# Altium schematic sheet LPC1830 Main Controller.SchDoc
size C
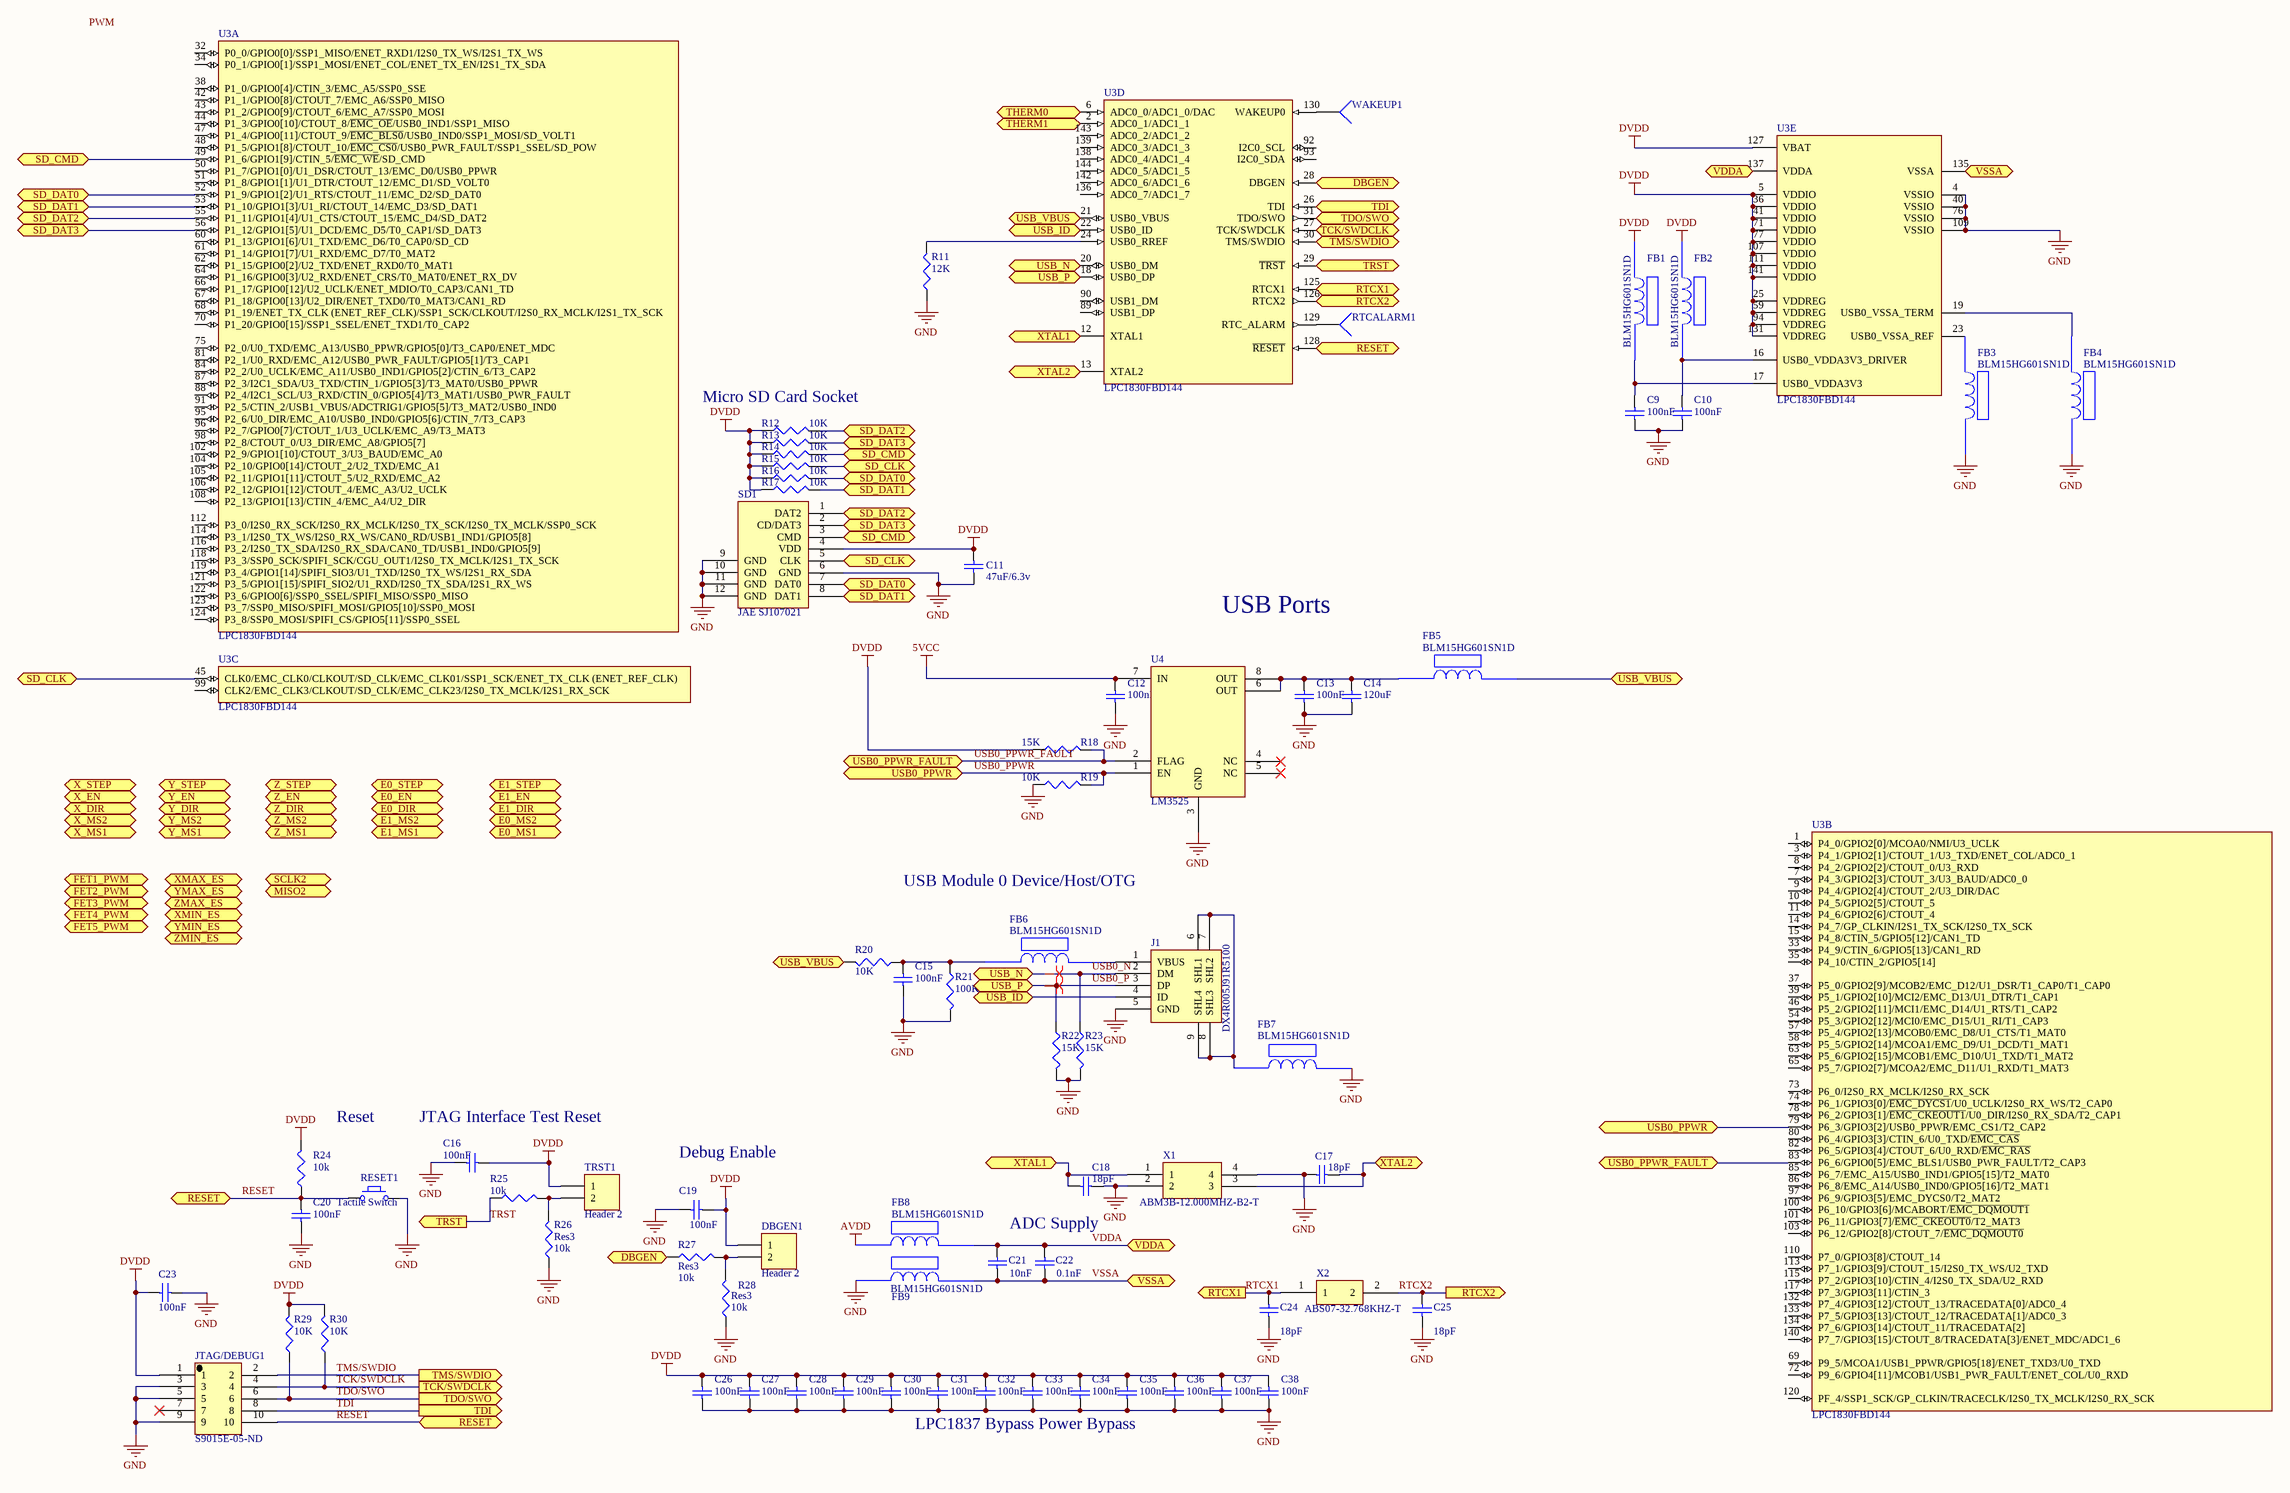
[diagram p0: LPC1830 Main Controller.SchDoc]

## Parts
C9  value 100nF  [0402]  (hidden comment: Cap Semi)
C10  value 100nF  [0402]  (hidden comment: Cap Semi)
C11  value 47uF/6.3v  [Panasonic VS B]  (hidden comment: Cap Semi)
C12  value 100nF  [1608[0603]]  (hidden comment: Cap Semi)
C13  value 100nF  [1608[0603]]  (hidden comment: Cap Semi)
C14  value 120uF  [1608[0603]]  (hidden comment: Cap Semi)
C15  value 100nF  [1608[0603]]  (hidden comment: Cap Semi)
C16  C1: 100nF  [CAPC1608L]  (hidden comment: Cap Semi)
C17  value 18pF  [1608[0603]]  (hidden comment: Cap Semi)
C18  value 18pF  [1608[0603]]  (hidden comment: Cap Semi)
C19  C1: 100nF  [CAPC1608L]  (hidden comment: Cap Semi)
C20  C1: 100nF  [CAPC1608L]  (hidden comment: Cap Semi)
C21  value 10nF  [1608[0603]]  (hidden comment: Cap Semi)
C22  value 0.1nF  [1608[0603]]  (hidden comment: Cap Semi)
C23  C1: 100nF  [CAPC1608L]  (hidden comment: Cap Semi)
C24  value 18pF  [1608[0603]]  (hidden comment: Cap Semi)
C25  value 18pF  [1608[0603]]  (hidden comment: Cap Semi)
C26  value 100nF  [1608[0603]]  (hidden comment: Cap Semi)
C27  value 100nF  [1608[0603]]  (hidden comment: Cap Semi)
C28  value 100nF  [1608[0603]]  (hidden comment: Cap Semi)
C29  value 100nF  [1608[0603]]  (hidden comment: Cap Semi)
C30  value 100nF  [1608[0603]]  (hidden comment: Cap Semi)
C31  value 100nF  [1608[0603]]  (hidden comment: Cap Semi)
C32  value 100nF  [1608[0603]]  (hidden comment: Cap Semi)
C33  value 100nF  [1608[0603]]  (hidden comment: Cap Semi)
C34  value 100nF  [1608[0603]]  (hidden comment: Cap Semi)
C35  value 100nF  [1608[0603]]  (hidden comment: Cap Semi)
C36  value 100nF  [1608[0603]]  (hidden comment: Cap Semi)
C37  value 100nF  [1608[0603]]  (hidden comment: Cap Semi)
C38  value 100nF  [1608[0603]]  (hidden comment: Cap Semi)
DBGEN1  Header 2  [HDR1X2]
FB1  BLM15HG601SN1D  [BLM18PG121SN1D]
FB2  BLM15HG601SN1D  [BLM18PG121SN1D]
FB3  BLM15HG601SN1D  [BLM18PG121SN1D]
FB4  BLM15HG601SN1D  [BLM18PG121SN1D]
FB5  BLM15HG601SN1D  [BLM18PG121SN1D]
FB6  BLM15HG601SN1D  [BLM18PG121SN1D]
FB7  BLM15HG601SN1D  [BLM18PG121SN1D]
FB8  BLM15HG601SN1D  [BLM18PG121SN1D]
FB9  BLM15HG601SN1D  [BLM18PG121SN1D]
J1  DX4R005J91R5100  [Micro USB Circular Holes Only]
JTAG/DEBUG1  S9015E-05-ND  [S9015E-05-ND]
R11  value 12K  [J1-0603]  (hidden comment: Res3)
R12  value 10K  [J1-0603]  (hidden comment: Res3)
R13  value 10K  [J1-0603]  (hidden comment: Res3)
R14  value 10K  [J1-0603]  (hidden comment: Res3)
R15  value 10K  [J1-0603]  (hidden comment: Res3)
R16  value 10K  [J1-0603]  (hidden comment: Res3)
R17  value 10K  [J1-0603]  (hidden comment: Res3)
R18  value 15K  [J1-0603]  (hidden comment: Res3)
R19  value 10K  [J1-0603]  (hidden comment: Res3)
R20  value 10K  [J1-0603]  (hidden comment: Res3)
R21  value 100K  [J1-0603]  (hidden comment: Res3)
R22  value 15K  [J1-0603]  (hidden comment: Res3)
R23  value 15K  [J1-0603]  (hidden comment: Res3)
R24  value 10k  [J1-0603]  (hidden comment: Res3)
R25  value 10k  [J1-0603]  (hidden comment: Res3)
R26  Res3  value 10k  [J1-0603]
R27  Res3  value 10k  [J1-0603]
R28  Res3  value 10k  [J1-0603]
R29  value 10K  [J1-0603]  (hidden comment: Res3)
R30  value 10K  [J1-0603]  (hidden comment: Res3)
RESET1  Tactile Switch  [TL3301]
RTCALARM1  Socket  [PIN1]  (value not drawn)
SD1  JAE SJ107021  [JAE SJ107021]
TRST1  Header 2  [HDR1X2]
U3  LPC1830FBD144  [SOT486-1_V]  (parts A,B,C,D,E of 5)
U4  LM3525  [LM3525]
WAKEUP1  Socket  [PIN1]  (value not drawn)
X1  ABM3B-12.000MHZ-B2-T  [ABM3B-12.000MHZ-B2-T]
X2  ABS07-32.768KHZ-T  [ABS07-32.768KHZ-T]

## Ports
DBGEN (in), DBGEN (out), E0_DIR, E0_EN, E0_MS1, E0_MS2, E0_STEP, E1_DIR, E1_EN, E1_MS1, E1_MS2, E1_STEP, FET1_PWM, FET2_PWM, FET3_PWM, FET4_PWM, FET5_PWM, MISO2, RESET (bidir), RTCX1 (in), RTCX1 (out), RTCX2 (out), SCLK2, SD_CLK (bidir), SD_CMD (bidir), SD_DAT0 (bidir), SD_DAT1 (bidir), SD_DAT2 (bidir), SD_DAT3 (bidir), TCK/SWDCLK (in), TCK/SWDCLK (out), TDI (in), TDI (out), TDO/SWO (out), THERM0, THERM1, TMS/SWDIO (in), TMS/SWDIO (out), TRST (in), TRST (out), USB0_PPWR (bidir), USB0_PPWR_FAULT (bidir), USB_ID (bidir), USB_N (bidir), USB_P (bidir), USB_VBUS (bidir), VDDA, VSSA, X_DIR, X_EN, X_MS1, X_MS2, X_STEP, XMAX_ES, XMIN_ES, XTAL1 (bidir), XTAL2 (bidir), Y_DIR, Y_EN, Y_MS1, Y_MS2, Y_STEP, YMAX_ES, YMIN_ES, Z_DIR, Z_EN, Z_MS1, Z_MS2, Z_STEP, ZMAX_ES, ZMIN_ES

## Nets
5VCC: C12.2 U4.7(IN)
AVDD: FB8.1
DVDD: C11.2 C16.2 C19.2 C23.1 C26.2 C27.2 C28.2 C29.2 C30.2 C31.2 C32.2 C33.2 C34.2 C35.2 C36.2 C37.2 C38.2 DBGEN1.1 FB1.1 FB2.1 JTAG/DEBUG1.1 R12.1 R13.1 R14.1 R15.1 R16.1 R17.1 R18.1 R24.2 R29.2 R30.2 SD1.4(VDD) TRST1.1 U3.5(VDDIO) U3.25(VDDREG) U3.36(VDDIO) U3.41(VDDIO) U3.59(VDDREG) U3.71(VDDIO) U3.77(VDDIO) U3.94(VDDREG) U3.107(VDDIO) U3.111(VDDIO) U3.127(VBAT) U3.131(VDDREG) U3.141(VDDIO)
GND: C9.1 C10.1 C11.1 C12.1 C13.1 C14.1 C15.1 C16.1 C17.2 C18.1 C19.1 C20.1 C23.2 C24.1 C25.1 C26.1 C27.1 C28.1 C29.1 C30.1 C31.1 C32.1 C33.1 C34.1 C35.1 C36.1 C37.1 C38.1 FB3.2 FB4.2 FB7.2 FB9.1 J1.5(GND) JTAG/DEBUG1.3 JTAG/DEBUG1.5 JTAG/DEBUG1.9 R11.1 R19.1 R21.2 R22.2 R23.2 R26.1 R28.1 RESET1.2 SD1.6(GND) SD1.9(GND) SD1.10(GND) SD1.11(GND) SD1.12(GND) U3.4(VSSIO) U3.40(VSSIO) U3.76(VSSIO) U3.109(VSSIO) U4.3(GND) X1.2 X1.4
DBGEN: R27.1 U3.28(DBGEN) ; port DBGEN
RESET: C20.2 JTAG/DEBUG1.10 R24.1 RESET1.1 U3.128(~{RESET}) ; port RESET
RTCX1: C24.2 U3.125(RTCX1) X2.1 ; port RTCX1
RTCX2: C25.2 U3.126(RTCX2) X2.2 ; port RTCX2
SD_CLK: R15.2 SD1.5(CLK) U3.45(CLK0/EMC_CLK0/CLKOUT/SD_CLK/EMC_CLK01/SSP1_SCK/ENET_TX_CLK_(ENET_REF_CLK)) ; port SD_CLK
SD_CMD: R14.2 SD1.3(CMD) U3.49(P1_6/GPIO1[9]/CTIN_5/~{EMC_WE}/SD_CMD) ; port SD_CMD
SD_DAT0: R16.2 SD1.7(DAT0) U3.52(P1_9/GPIO1[2]/U1_RTS/CTOUT_11/EMC_D2/SD_DAT0) ; port SD_DAT0
SD_DAT1: R17.2 SD1.8(DAT1) U3.53(P1_10/GPIO1[3]/U1_RI/CTOUT_14/EMC_D3/SD_DAT1) ; port SD_DAT1
SD_DAT2: R12.2 SD1.1(DAT2) U3.55(P1_11/GPIO1[4]/U1_CTS/CTOUT_15/EMC_D4/SD_DAT2) ; port SD_DAT2
SD_DAT3: R13.2 SD1.2(CD/DAT3) U3.56(P1_12/GPIO1[5]/U1_DCD/EMC_D5/T0_CAP1/SD_DAT3) ; port SD_DAT3
TCK/SWDCLK: JTAG/DEBUG1.4 R30.1 U3.27(TCK/SWDCLK) ; port TCK/SWDCLK
TDI: JTAG/DEBUG1.8 U3.26(TDI) ; port TDI
TDO/SWO: JTAG/DEBUG1.6 R29.1 U3.31(TDO/SWO) ; port TDO/SWO
THERM0: U3.6(ADC0_0/ADC1_0/DAC) ; port THERM0
THERM1: U3.2(ADC0_1/ADC1_1) ; port THERM1
TMS/SWDIO: JTAG/DEBUG1.2 U3.30(TMS/SWDIO) ; port TMS/SWDIO
TRST: R25.1 U3.29(~{TRST}) ; port TRST
USB0_N: J1.2(DM) R23.1 U3.20(USB0_DM) ; port USB_N
USB0_P: J1.3(DP) R22.1 U3.18(USB0_DP) ; port USB_P
USB0_PPWR: R19.2 U3.79(P6_3/GPIO3[2]/USB0_PPWR/EMC_CS1/T2_CAP2) U4.1(EN) ; port USB0_PPWR
USB0_PPWR_FAULT: R18.2 U3.83(P6_6/GPIO0[5]/EMC_BLS1/USB0_PWR_FAULT/T2_CAP3) U4.2(FLAG) ; port USB0_PPWR_FAULT
USB_ID: J1.4(ID) U3.22(USB0_ID) ; port USB_ID
USB_VBUS: FB5.2 R20.2 U3.21(USB0_VBUS) ; port USB_VBUS
VDDA: C21.2 C22.2 FB8.2 U3.137(VDDA) ; port VDDA
VSSA: C21.1 C22.1 FB9.2 U3.135(VSSA) ; port VSSA
XTAL1: C18.2 U3.12(XTAL1) X1.1 ; port XTAL1
XTAL2: C17.1 U3.13(XTAL2) X1.3 ; port XTAL2
NetC9_2: C9.2 FB1.2 U3.17(USB0_VDDA3V3)
NetC10_2: C10.2 FB2.2 U3.16(USB0_VDDA3V3_DRIVER)
NetC13_2: C13.2 C14.2 FB5.1 U4.6(OUT) U4.8(OUT)
NetC15_2: C15.2 FB6.1 R20.1 R21.1
NetDBGEN1_2: DBGEN1.2 R27.2 R28.2
NetFB3_1: FB3.1 U3.23(USB0_VSSA_REF)
NetFB4_1: FB4.1 U3.19(USB0_VSSA_TERM)
NetFB6_2: FB6.2 J1.1(VBUS)
NetFB7_1: FB7.1 J1.6(SHL1) J1.7(SHL2) J1.8(SHL3) J1.9(SHL4)
NetR11_2: R11.2 U3.24(USB0_RREF)
NetR25_2: R25.2 R26.2 TRST1.2
NetRTCALARM1_1: RTCALARM1.1 U3.129(RTC_ALARM)
NetU3_130: U3.130(WAKEUP0) WAKEUP1.1

Not connected (* = marked no-connect by the designer): JTAG/DEBUG1 7*; U3 1(P4_0/GPIO2[0]/MCOA0/NMI/U3_UCLK) 3(P4_1/GPIO2[1]/CTOUT_1/U3_TXD/ENET_COL/ADC0_1) 7(P4_3/GPIO2[3]/CTOUT_3/U3_BAUD/ADC0_0) 8(P4_2/GPIO2[2]/CTOUT_0/U3_RXD) 9(P4_4/GPIO2[4]/CTOUT_2/U3_DIR/DAC) 10(P4_5/GPIO2[5]/CTOUT_5) 11(P4_6/GPIO2[6]/CTOUT_4) 14(P4_7/GP_CLKIN/I2S1_TX_SCK/I2S0_TX_SCK) 15(P4_8/CTIN_5/GPIO5[12]/CAN1_TD) 32(P0_0/GPIO0[0]/SSP1_MISO/ENET_RXD1/I2S0_TX_WS/I2S1_TX_WS) 33(P4_9/CTIN_6/GPIO5[13]/CAN1_RD) 34(P0_1/GPIO0[1]/SSP1_MOSI/ENET_COL/ENET_TX_EN/I2S1_TX_SDA) 35(P4_10/CTIN_2/GPIO5[14]) 37(P5_0/GPIO2[9]/MCOB2/EMC_D12/U1_DSR/T1_CAP0/T1_CAP0) 38(P1_0/GPIO0[4]/CTIN_3/EMC_A5/SSP0_SSE) 39(P5_1/GPIO2[10]/MCI2/EMC_D13/U1_DTR/T1_CAP1) 42(P1_1/GPIO0[8]/CTOUT_7/EMC_A6/SSP0_MISO) 43(P1_2/GPIO0[9]/CTOUT_6/EMC_A7/SSP0_MOSI) 44(P1_3/GPIO0[10]/CTOUT_8/~{EMC_OE}/USB0_IND1/SSP1_MISO) 46(P5_2/GPIO2[11]/MCI1/EMC_D14/U1_RTS/T1_CAP2) 47(P1_4/GPIO0[11]/CTOUT_9/~{EMC_BLS0}/USB0_IND0/SSP1_MOSI/SD_VOLT1) 48(P1_5/GPIO1[8]/CTOUT_10/~{EMC_CS0}/USB0_PWR_FAULT/SSP1_SSEL/SD_POW) 50(P1_7/GPIO1[0]/U1_DSR/CTOUT_13/EMC_D0/USB0_PPWR) 51(P1_8/GPIO1[1]/U1_DTR/CTOUT_12/EMC_D1/SD_VOLT0) 54(P5_3/GPIO2[12]/MCI0/EMC_D15/U1_RI/T1_CAP3) 57(P5_4/GPIO2[13]/MCOB0/EMC_D8/U1_CTS/T1_MAT0) 58(P5_5/GPIO2[14]/MCOA1/EMC_D9/U1_DCD/T1_MAT1) 60(P1_13/GPIO1[6]/U1_TXD/EMC_D6/T0_CAP0/SD_CD) 61(P1_14/GPIO1[7]/U1_RXD/EMC_D7/T0_MAT2) 62(P1_15/GPIO0[2]/U2_TXD/ENET_RXD0/T0_MAT1) 63(P5_6/GPIO2[15]/MCOB1/EMC_D10/U1_TXD/T1_MAT2) 64(P1_16/GPIO0[3]/U2_RXD/ENET_CRS/T0_MAT0/ENET_RX_DV) 65(P5_7/GPIO2[7]/MCOA2/EMC_D11/U1_RXD/T1_MAT3) 66(P1_17/GPIO0[12]/U2_UCLK/ENET_MDIO/T0_CAP3/CAN1_TD) 67(P1_18/GPIO0[13]/U2_DIR/ENET_TXD0/T0_MAT3/CAN1_RD) 68(P1_19/ENET_TX_CLK_(ENET_REF_CLK)/SSP1_SCK/CLKOUT/I2S0_RX_MCLK/I2S1_TX_SCK) 69(P9_5/MCOA1/USB1_PPWR/GPIO5[18]/ENET_TXD3/U0_TXD) 70(P1_20/GPIO0[15]/SSP1_SSEL/ENET_TXD1/T0_CAP2) 72(P9_6/GPIO4[11]/MCOB1/USB1_PWR_FAULT/ENET_COL/U0_RXD) 73(P6_0/I2S0_RX_MCLK/I2S0_RX_SCK) 74(P6_1/GPIO3[0]/~{EMC_DYCS1}/U0_UCLK/I2S0_RX_WS/T2_CAP0) 75(P2_0/U0_TXD/EMC_A13/USB0_PPWR/GPIO5[0]/T3_CAP0/ENET_MDC) 78(P6_2/GPIO3[1]/~{EMC_CKEOUT1}/U0_DIR/I2S0_RX_SDA/T2_CAP1) 80(P6_4/GPIO3[3]/CTIN_6/U0_TXD/~{EMC_CAS}) 81(P2_1/U0_RXD/EMC_A12/USB0_PWR_FAULT/GPIO5[1]/T3_CAP1) 82(P6_5/GPIO3[4]/CTOUT_6/U0_RXD/~{EMC_RAS}) 84(P2_2/U0_UCLK/EMC_A11/USB0_IND1/GPIO5[2]/CTIN_6/T3_CAP2) 85(P6_7/EMC_A15/USB0_IND1/GPIO5[15]/T2_MAT0) 86(P6_8/EMC_A14/USB0_IND0/GPIO5[16]/T2_MAT1) 87(P2_3/I2C1_SDA/U3_TXD/CTIN_1/GPIO5[3]/T3_MAT0/USB0_PPWR) 88(P2_4/I2C1_SCL/U3_RXD/CTIN_0/GPIO5[4]/T3_MAT1/USB0_PWR_FAULT) 89(USB1_DP) 90(USB1_DM) 91(P2_5/CTIN_2/USB1_VBUS/ADCTRIG1/GPIO5[5]/T3_MAT2/USB0_IND0) 92(I2C0_SCL) 93(I2C0_SDA) 95(P2_6/U0_DIR/EMC_A10/USB0_IND0/GPIO5[6]/CTIN_7/T3_CAP3) 96(P2_7/GPIO0[7]/CTOUT_1/U3_UCLK/EMC_A9/T3_MAT3) 97(P6_9/GPIO3[5]/EMC_DYCS0/T2_MAT2) 98(P2_8/CTOUT_0/U3_DIR/EMC_A8/GPIO5[7]) 99(CLK2/EMC_CLK3/CLKOUT/SD_CLK/EMC_CLK23/I2S0_TX_MCLK/I2S1_RX_SCK) 100(P6_10/GPIO3[6]/MCABORT/~{EMC_DQMOUT1}) 101(P6_11/GPIO3[7]/~{EMC_CKEOUT0}/T2_MAT3) 102(P2_9/GPIO1[10]/CTOUT_3/U3_BAUD/EMC_A0) 103(P6_12/GPIO2[8]/CTOUT_7/~{EMC_DQMOUT0}) 104(P2_10/GPIO0[14]/CTOUT_2/U2_TXD/EMC_A1) 105(P2_11/GPIO1[11]/CTOUT_5/U2_RXD/EMC_A2) 106(P2_12/GPIO1[12]/CTOUT_4/EMC_A3/U2_UCLK) 108(P2_13/GPIO1[13]/CTIN_4/EMC_A4/U2_DIR) 110(P7_0/GPIO3[8]/CTOUT_14) 112(P3_0/I2S0_RX_SCK/I2S0_RX_MCLK/I2S0_TX_SCK/I2S0_TX_MCLK/SSP0_SCK) 113(P7_1/GPIO3[9]/CTOUT_15/I2S0_TX_WS/U2_TXD) 114(P3_1/I2S0_TX_WS/I2S0_RX_WS/CAN0_RD/USB1_IND1/GPIO5[8]) 115(P7_2/GPIO3[10]/CTIN_4/I2S0_TX_SDA/U2_RXD) 116(P3_2/I2S0_TX_SDA/I2S0_RX_SDA/CAN0_TD/USB1_IND0/GPIO5[9]) 117(P7_3/GPIO3[11]/CTIN_3) 118(P3_3/SSP0_SCK/SPIFI_SCK/CGU_OUT1/I2S0_TX_MCLK/I2S1_TX_SCK) 119(P3_4/GPIO1[14]/SPIFI_SIO3/U1_TXD/I2S0_TX_WS/I2S1_RX_SDA) 120(PF_4/SSP1_SCK/GP_CLKIN/TRACECLK/I2S0_TX_MCLK/I2S0_RX_SCK) 121(P3_5/GPIO1[15]/SPIFI_SIO2/U1_RXD/I2S0_TX_SDA/I2S1_RX_WS) 122(P3_6/GPIO0[6]/SSP0_SSEL/SPIFI_MISO/SSP0_MISO) 123(P3_7/SSP0_MISO/SPIFI_MOSI/GPIO5[10]/SSP0_MOSI) 124(P3_8/SSP0_MOSI/SPIFI_CS/GPIO5[11]/SSP0_SSEL) 132(P7_4/GPIO3[12]/CTOUT_13/TRACEDATA[0]/ADC0_4) 133(P7_5/GPIO3[13]/CTOUT_12/TRACEDATA[1]/ADC0_3) 134(P7_6/GPIO3[14]/CTOUT_11/TRACEDATA[2]) 136(ADC0_7/ADC1_7) 138(ADC0_4/ADC1_4) 139(ADC0_3/ADC1_3) 140(P7_7/GPIO3[15]/CTOUT_8/TRACEDATA[3]/ENET_MDC/ADC1_6) 142(ADC0_6/ADC1_6) 143(ADC0_2/ADC1_2) 144(ADC0_5/ADC1_5); U4 4(NC)* 5(NC)*

## Layout directives
differential pair: USB0_N, USB0_P

## Notes on the sheet
- Micro SD Card Socket
- USB Ports
- USB Module 0 Device/Host/OTG
- (near R24) Reset
- (near C16) JTAG Interface Test Reset
- Debug Enable
- ADC Supply
- LPC1837 Bypass Power Bypass
- Labels drawn without touching a wire or pin: PWM

## Library data of the parts
C9-C38 = Cap Semi: Capacitor (Semiconductor SIM Model); Published: 8-Jun-2000; LatestRevisionDate: 29-May-2009; LatestRevisionNote: IPC-7351 Footprint Added.; PackageReference: C1206; Publisher: Altium Limited; PackageDescription: Chip Capacitor
DBGEN1 TRST1 = Header 2: Header, 2-Pin; LatestRevisionDate: 17-Jul-2002; LatestRevisionNote: Re-released for DXP Platform.; Publisher: Altium Limited
J1 = Micro USB: Micro USB Jack B
R11-R30 = Res3: Resistor; Published: 8-Jun-2000; LatestRevisionDate: 29-May-2009; LatestRevisionNote: IPC-7351 Footprint Added.; PackageReference: J1-0603; Publisher: Altium Limited; PackageDescription: Chip Resistor
SD1 = JAE SJ107021 microSD Card Socket
U3 = LPC1830FBD144: 32-bit ARM Cortex-M3 MCU, 200 kB SRAM, 2 HS USB, on-chip PHY, Ethernet, CAN, AES, SPIFI, SCT, 144-Pin LQFP; fmax: 180 MHz; SRAM: 200 kB; GPIOs: 83; USB: 2; UART: 4; I2C: 1; PLL: Y; ADC channels: 8; VDD (min): 2.2 V; VDD (typ): 3.3 V; VDD (max): 3.6 V; Code_IEC: 136E23; DatasheetVersion: Rev. 3.1, Dec-2011; PackageVersion: Feb-2003; PackageReference: SOT486-1; PackageDescription: LQFP144: Plastic Low Profile Quad Flat Package; 144 Leads; Body 20 x 20 x 1.4 mm; CAN: 2; SPI: 1; PWM: 1; Timers: 4; Code_JEDEC: MS-026; ComponentLink1Description: Manufacturer URL; ComponentLink1URL: http://www.nxp.com/; ComponentLink2Description: Datasheet; ComponentLink2URL: http://www.nxp.com/documents/data_sheet/LPC1850_30_20_10.pdf
X2 = ABS07-32.768KHZ-T: ABS07-32.768KHZ-T RTC Crystal Oscillator
RTCALARM1 WAKEUP1 = Socket: LatestRevisionDate: 17-Jul-2002; LatestRevisionNote: Re-released for DXP Platform.; Publisher: Altium Limited